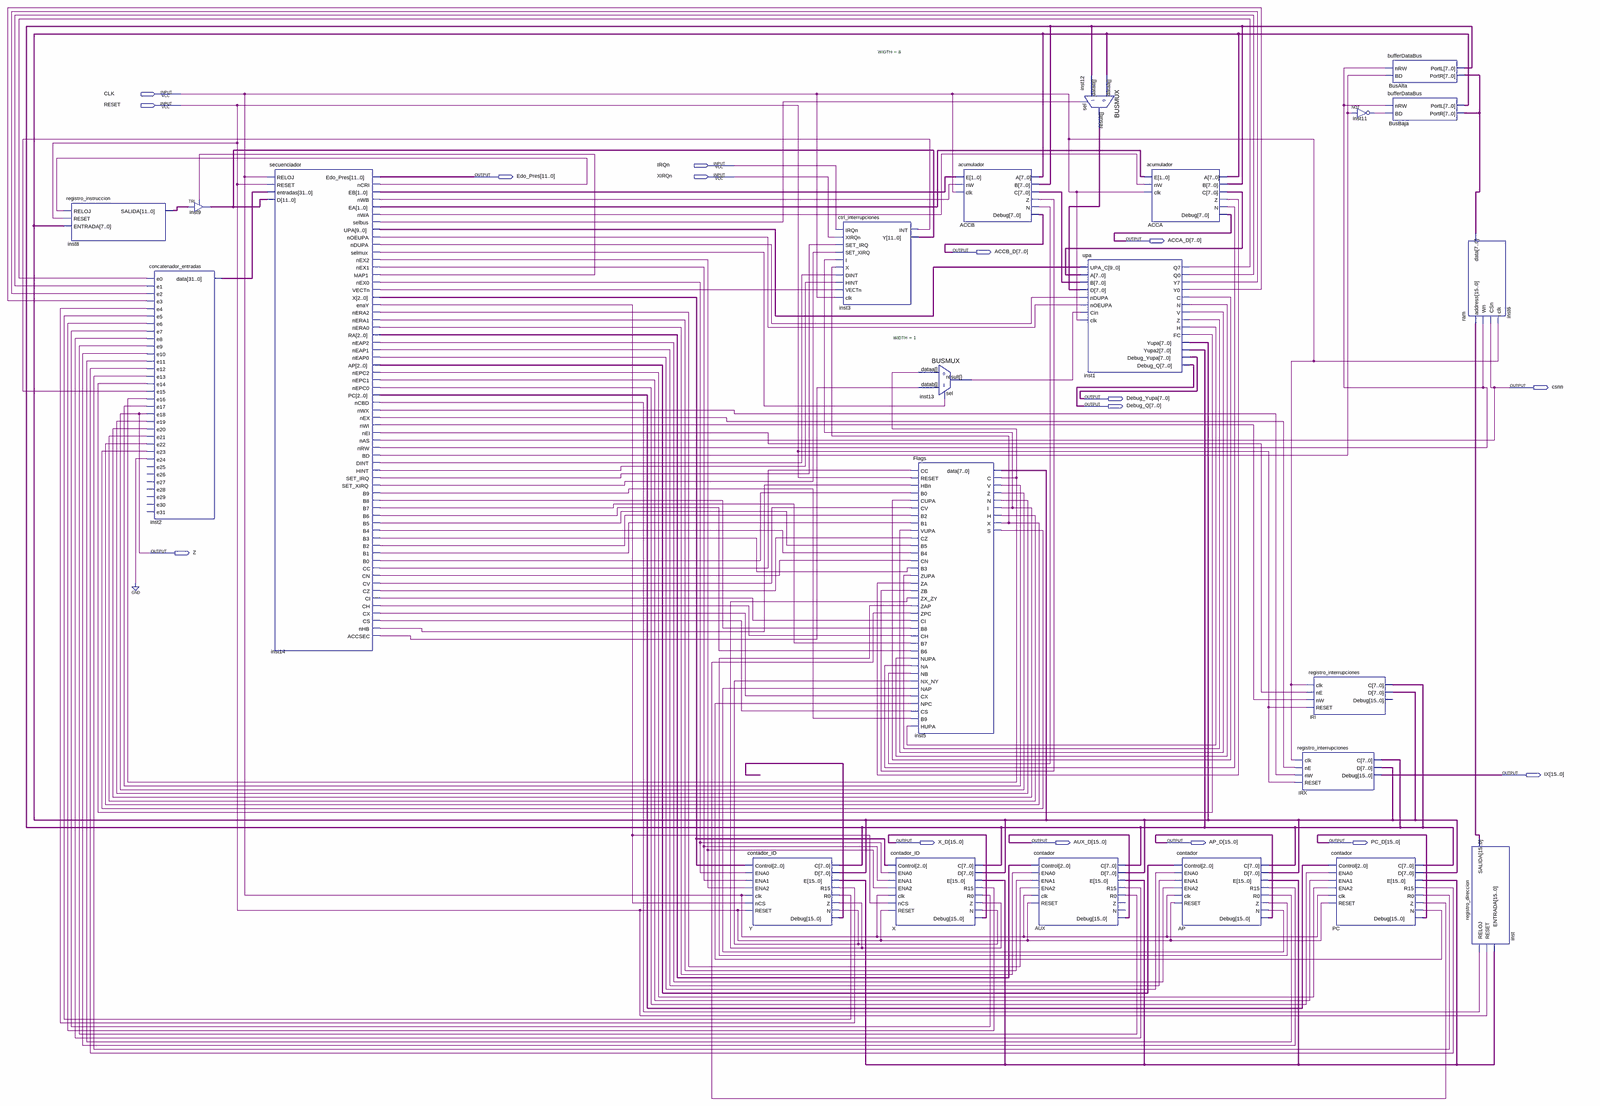
[diagram p0: schematic sheet, whole]
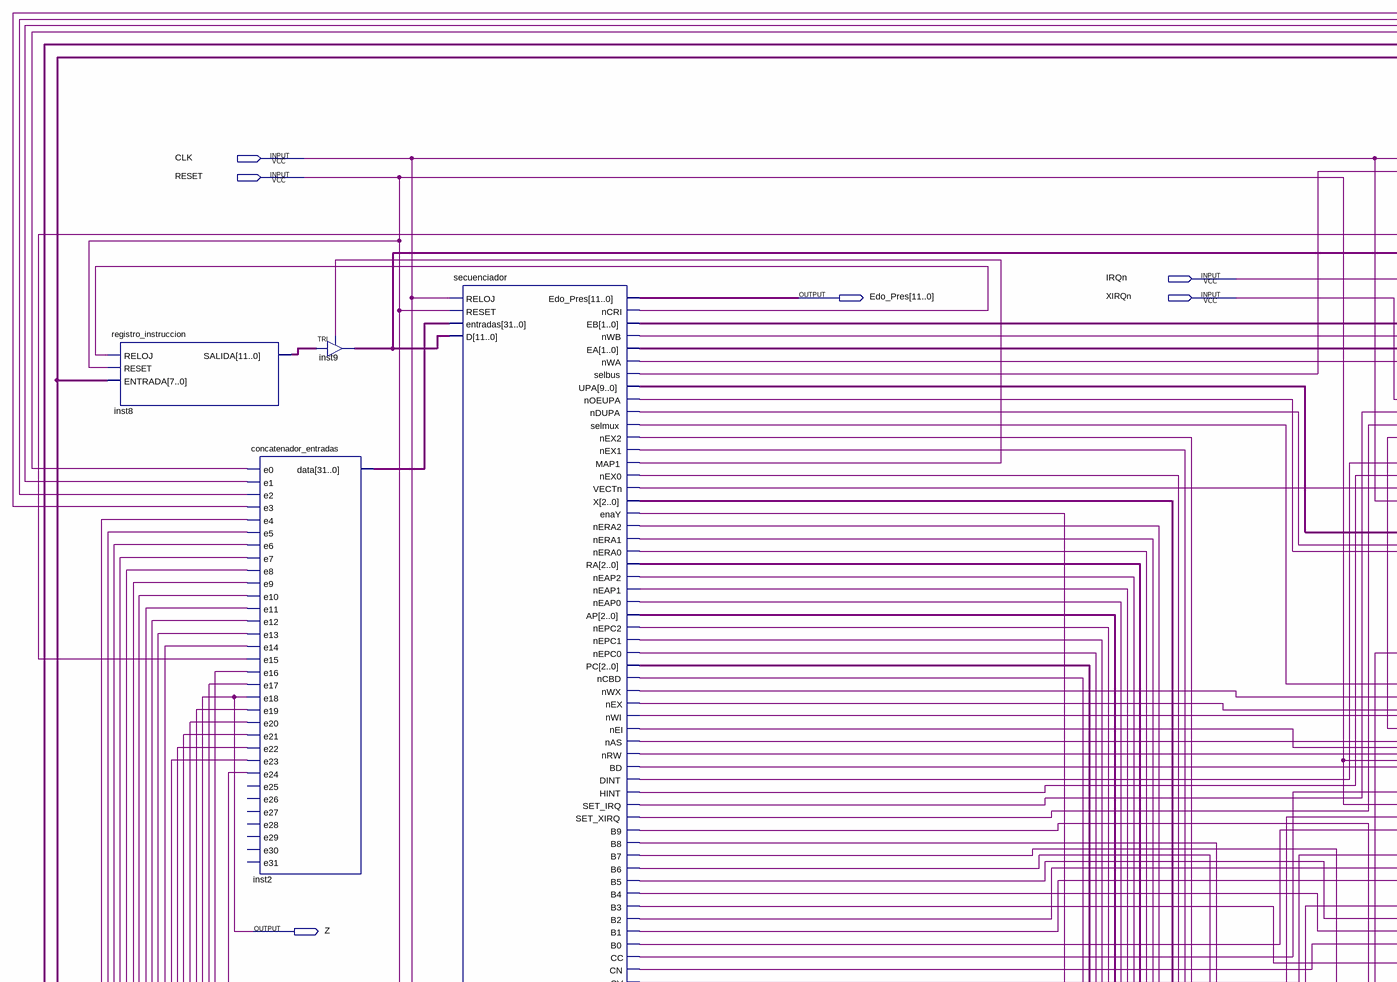
[diagram p1: schematic sheet, upper left part]
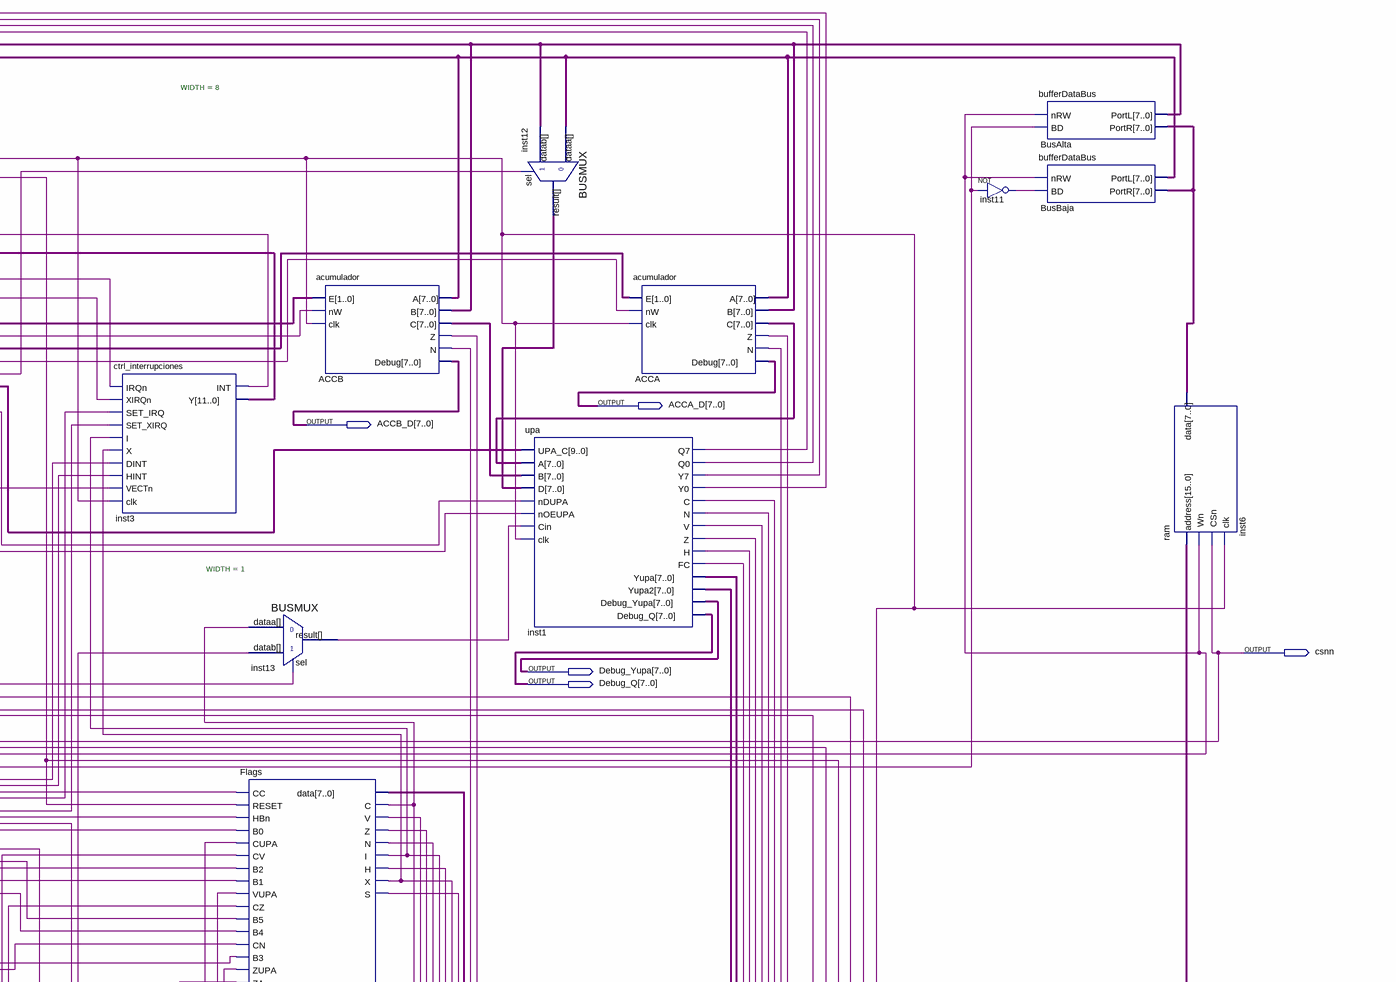
[diagram p2: schematic sheet, upper right part]
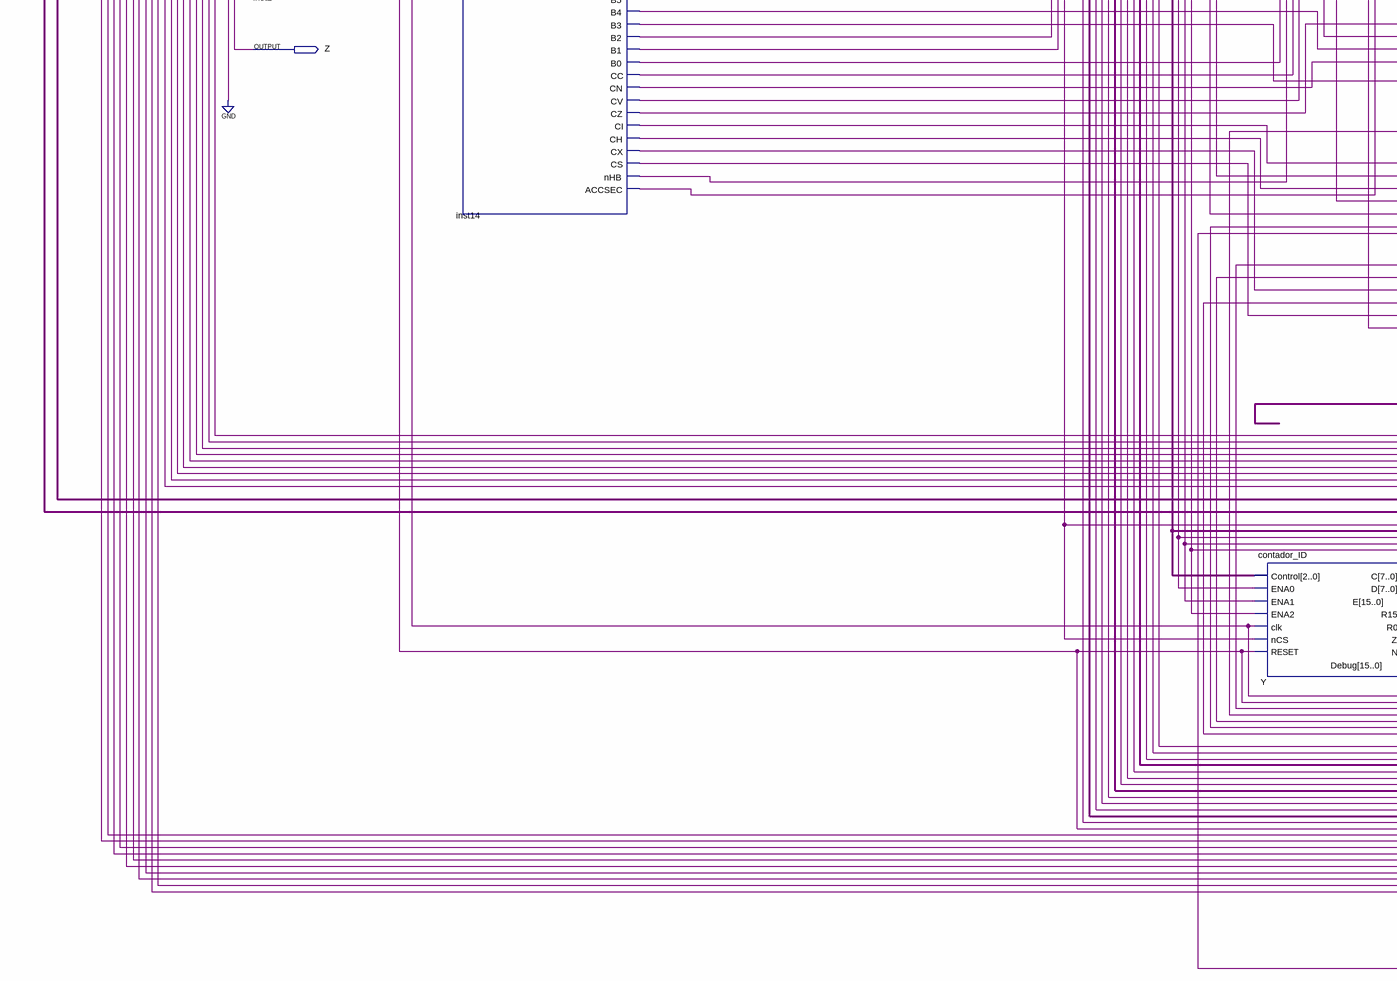
[diagram p3: schematic sheet, lower left part]
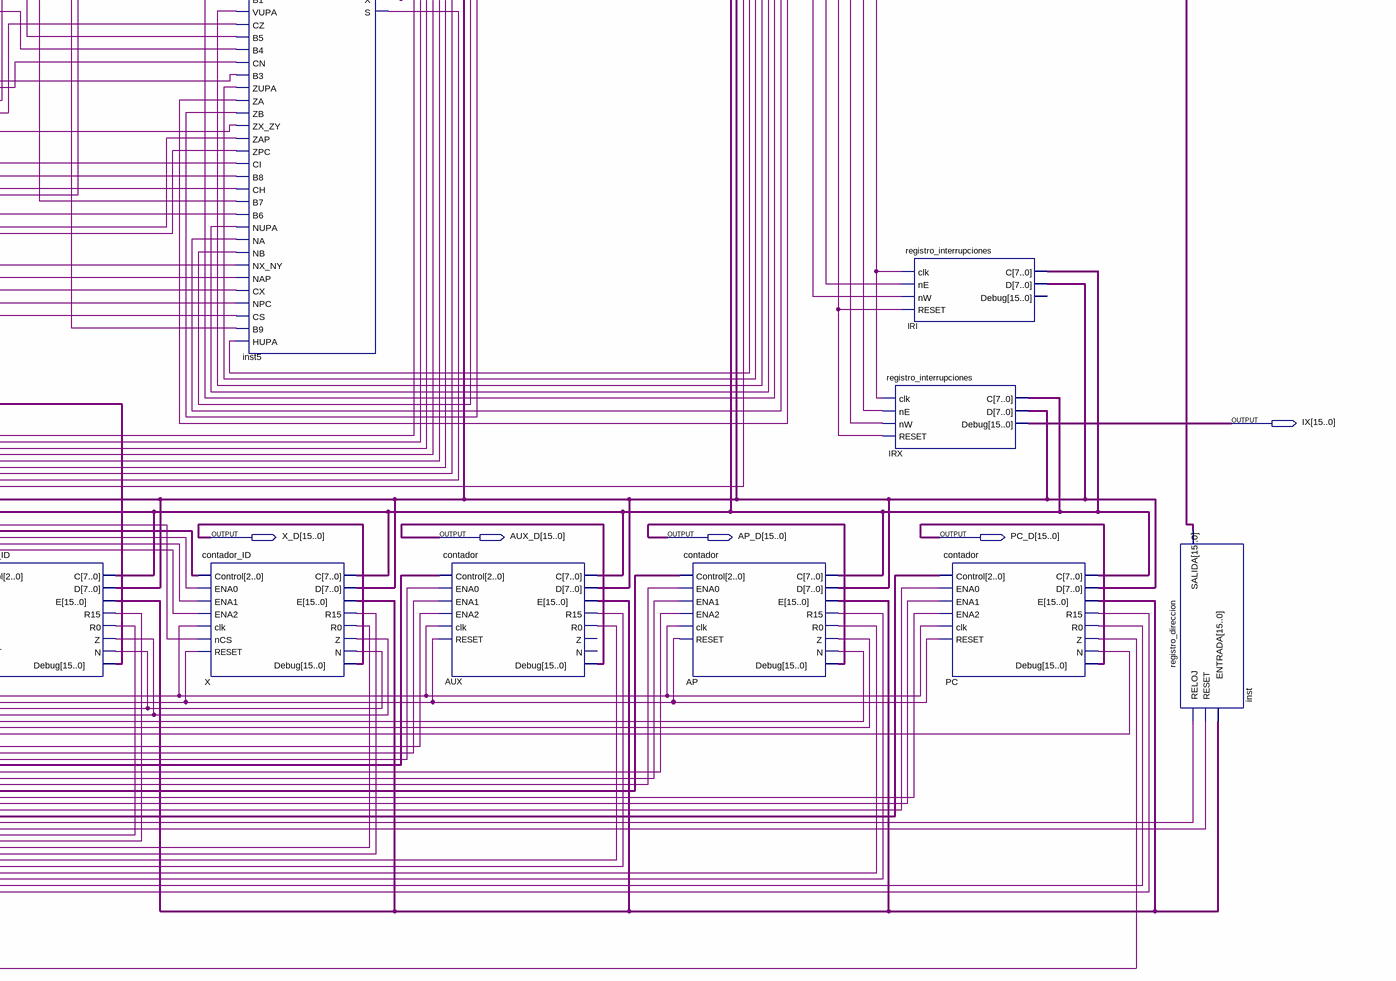
[diagram p4: schematic sheet, lower right part]
// Quartus schematic m68hc11.bdf as structural Verilog: 23 symbols, 16 pins
module m68hc11 (
  input  CLK,
  input  RESET,
  input  IRQn,
  input  XIRQn,
  output [11:0] Edo_Pres,
  output [7:0] ACCA_D,
  output [7:0] ACCB_D,
  output csnn,
  output [7:0] Debug_Yupa,
  output [7:0] Debug_Q,
  output Z,
  output [15:0] IX,
  output [15:0] X_D,
  output [15:0] AUX_D,
  output [15:0] AP_D,
  output [15:0] PC_D
);

  wire ACCA_n, ACCA_z, ACCB_n, ACCB_z, AP_n, AP_r0, AP_r15, AP_z, AUX_r0, AUX_r15, inst1_c, inst1_fc,
       inst1_h, inst1_n, inst1_q0, inst1_q7, inst1_v, inst1_y0, inst1_y7, inst1_z, inst3_int, inst5_c,
       inst5_h, inst5_i, inst5_n, inst5_s, inst5_v, inst5_x, inst11_out, inst13_result, inst14_accsec,
       inst14_b0, inst14_b1, inst14_b2, inst14_b3, inst14_b4, inst14_b5, inst14_b6, inst14_b7, inst14_b8,
       inst14_b9, inst14_bd, inst14_cc, inst14_ch, inst14_ci, inst14_cn, inst14_cs, inst14_cv, inst14_cx,
       inst14_cz, inst14_dint, inst14_enay, inst14_hint, inst14_map1, inst14_ncbd, inst14_ncri, inst14_ndupa,
       inst14_neap0, inst14_neap1, inst14_neap2, inst14_nei, inst14_nepc0, inst14_nepc1, inst14_nepc2,
       inst14_nera0, inst14_nera1, inst14_nera2, inst14_nex, inst14_nex0, inst14_nex1, inst14_nex2,
       inst14_nhb, inst14_noeupa, inst14_nrw, inst14_nwa, inst14_nwb, inst14_nwi, inst14_nwx, inst14_selbus,
       inst14_selmux, inst14_set_irq, inst14_set_xirq, inst14_vectn, PC_n, PC_r0, PC_r15, PC_z, X_r0, X_r15,
       Y_n, Y_r0, Y_r15, Y_z;
  wire [1:0] inst14_ea, inst14_eb;
  wire [2:0] inst14_ap, inst14_pc, inst14_ra, inst14_x;
  wire [7:0] ACCA_c, ACCB_c, BusAlta_portr, inst12_result, Y_c, Y_d;
  wire [9:0] inst14_upa;
  wire [11:0] inst8_salida, inst9_out;
  wire [15:0] inst_salida, Y_debug, Y_e;
  wire [31:0] inst2_data;

  registro_instruccion inst8 (.RELOJ(inst14_ncri), .RESET(RESET), .ENTRADA(Y_d), .SALIDA(inst8_salida));
  concatenador_entradas inst2 (
    .e0(inst1_q7), .e1(inst1_q0), .e2(inst1_y7), .e3(inst1_y0), .e4(Y_r15), .e5(Y_r0), .e6(X_r15), .e7(X_r0),
    .e8(AUX_r15), .e9(AUX_r0), .e10(AP_r15), .e11(AP_r0), .e12(PC_r15), .e13(PC_r0), .e14(inst1_fc),
    .e15(inst3_int), .e16(inst5_c), .e17(inst5_v), .e18(Z), .e19(inst5_n), .e20(inst5_i), .e21(inst5_h),
    .e22(inst5_x), .e23(inst5_s), .e24(1'b0), .data(inst2_data));  // open: e25, e26, e27, e28, e29, e30, e31
  TRI inst9[11:0] (.IN(inst8_salida), .OE(inst14_map1), .OUT(inst9_out));
  secuenciador inst14 (
    .RELOJ(CLK), .RESET(RESET), .entradas(inst2_data), .D(inst9_out), .Edo_Pres(Edo_Pres),
    .nCRI(inst14_ncri), .EB(inst14_eb), .nWB(inst14_nwb), .EA(inst14_ea), .nWA(inst14_nwa),
    .selbus(inst14_selbus), .UPA(inst14_upa), .nOEUPA(inst14_noeupa), .nDUPA(inst14_ndupa),
    .selmux(inst14_selmux), .nEX2(inst14_nex2), .nEX1(inst14_nex1), .MAP1(inst14_map1), .nEX0(inst14_nex0),
    .VECTn(inst14_vectn), .X(inst14_x), .enaY(inst14_enay), .nERA2(inst14_nera2), .nERA1(inst14_nera1),
    .nERA0(inst14_nera0), .RA(inst14_ra), .nEAP2(inst14_neap2), .nEAP1(inst14_neap1), .nEAP0(inst14_neap0),
    .AP(inst14_ap), .nEPC2(inst14_nepc2), .nEPC1(inst14_nepc1), .nEPC0(inst14_nepc0), .PC(inst14_pc),
    .nCBD(inst14_ncbd), .nWX(inst14_nwx), .nEX(inst14_nex), .nWI(inst14_nwi), .nEI(inst14_nei), .nAS(csnn),
    .nRW(inst14_nrw), .BD(inst14_bd), .DINT(inst14_dint), .HINT(inst14_hint), .SET_IRQ(inst14_set_irq),
    .SET_XIRQ(inst14_set_xirq), .B9(inst14_b9), .B8(inst14_b8), .B7(inst14_b7), .B6(inst14_b6),
    .B5(inst14_b5), .B4(inst14_b4), .B3(inst14_b3), .B2(inst14_b2), .B1(inst14_b1), .B0(inst14_b0),
    .CC(inst14_cc), .CN(inst14_cn), .CV(inst14_cv), .CZ(inst14_cz), .CI(inst14_ci), .CH(inst14_ch),
    .CX(inst14_cx), .CS(inst14_cs), .nHB(inst14_nhb), .ACCSEC(inst14_accsec));
  contador_ID Y (
    .Control(inst14_x), .ENA0(inst14_nex0), .ENA1(inst14_nex1), .ENA2(inst14_nex2), .clk(CLK),
    .nCS(inst14_enay), .RESET(RESET), .E(Y_e), .Z(Y_z), .N(Y_n), .Debug(Y_debug), .C(Y_c), .D(Y_d),
    .R15(Y_r15), .R0(Y_r0));
  ctrl_interrupciones inst3 (
    .IRQn(IRQn), .XIRQn(XIRQn), .SET_IRQ(inst14_set_irq), .SET_XIRQ(inst14_set_xirq), .I(inst5_i),
    .X(inst5_x), .DINT(inst14_dint), .HINT(inst14_hint), .VECTn(inst14_vectn), .clk(CLK), .INT(inst3_int),
    .Y(inst9_out));
  contador_ID X (
    .Control(inst14_x), .ENA0(inst14_nex0), .ENA1(inst14_nex1), .ENA2(inst14_nex2), .clk(CLK),
    .nCS(inst14_enay), .RESET(RESET), .E(Y_e), .Z(Y_z), .N(Y_n), .Debug(X_D), .C(Y_c), .D(Y_d), .R15(X_r15),
    .R0(X_r0));
  BUSMUX #(.WIDTH(1)) inst13 (.datab(inst14_accsec), .sel(inst14_selmux), .dataa(inst5_c), .result(inst13_result));
  Flags inst5 (
    .CC(inst14_cc), .RESET(RESET), .HBn(inst14_nhb), .B0(inst14_b0), .CUPA(inst1_c), .CV(inst14_cv),
    .B2(inst14_b2), .B1(inst14_b1), .VUPA(inst1_v), .CZ(inst14_cz), .B5(inst14_b5), .B4(inst14_b4),
    .CN(inst14_cn), .B3(inst14_b3), .ZUPA(inst1_z), .ZA(ACCA_z), .ZB(ACCB_z), .ZX_ZY(Y_z), .ZAP(AP_z),
    .ZPC(PC_z), .CI(inst14_ci), .B8(inst14_b8), .CH(inst14_ch), .B7(inst14_b7), .B6(inst14_b6),
    .NUPA(inst1_n), .NA(ACCA_n), .NB(ACCB_n), .NX_NY(Y_n), .NAP(AP_n), .CX(inst14_cx), .NPC(PC_n),
    .CS(inst14_cs), .B9(inst14_b9), .HUPA(inst1_h), .C(inst5_c), .V(inst5_v), .Z(Z), .N(inst5_n),
    .I(inst5_i), .H(inst5_h), .X(inst5_x), .S(inst5_s), .data(Y_d));
  acumulador ACCB (
    .E(inst14_eb), .nW(inst14_nwb), .clk(CLK), .Z(ACCB_z), .N(ACCB_n), .Debug(ACCB_D), .A(Y_d), .B(Y_c),
    .C(ACCB_c));
  contador AUX (
    .Control(inst14_ra), .ENA0(inst14_nera0), .ENA1(inst14_nera1), .ENA2(inst14_nera2), .clk(CLK),
    .RESET(RESET), .E(Y_e), .Debug(AUX_D), .C(Y_c), .D(Y_d), .R15(AUX_r15), .R0(AUX_r0));  // open: Z, N
  BUSMUX #(.WIDTH(8)) inst12 (.datab(Y_c), .sel(inst14_selbus), .dataa(Y_d), .result(inst12_result));
  upa inst1 (
    .UPA_C(inst14_upa), .A(ACCA_c), .B(ACCB_c), .D(inst12_result), .nDUPA(inst14_ndupa),
    .nOEUPA(inst14_noeupa), .Cin(inst13_result), .clk(CLK), .Q7(inst1_q7), .Q0(inst1_q0), .Y7(inst1_y7),
    .Y0(inst1_y0), .C(inst1_c), .N(inst1_n), .V(inst1_v), .Z(inst1_z), .H(inst1_h), .FC(inst1_fc),
    .Yupa(Y_d), .Yupa2(Y_c), .Debug_Yupa(Debug_Yupa), .Debug_Q(Debug_Q));
  acumulador ACCA (
    .E(inst14_ea), .nW(inst14_nwa), .clk(CLK), .Z(ACCA_z), .N(ACCA_n), .Debug(ACCA_D), .A(Y_d), .B(Y_c),
    .C(ACCA_c));
  contador AP (
    .Control(inst14_ap), .ENA0(inst14_neap0), .ENA1(inst14_neap1), .ENA2(inst14_neap2), .clk(CLK),
    .RESET(RESET), .E(Y_e), .Z(AP_z), .N(AP_n), .Debug(AP_D), .C(Y_c), .D(Y_d), .R15(AP_r15), .R0(AP_r0));
  registro_interrupciones IRX (
    .clk(CLK), .nE(inst14_nex), .nW(inst14_nwx), .RESET(RESET), .Debug(IX), .C(Y_c), .D(Y_d));
  registro_interrupciones IRI (
    .clk(CLK), .nE(inst14_nei), .nW(inst14_nwi), .RESET(RESET), .C(Y_c), .D(Y_d));  // open: Debug
  not inst11 (inst11_out, inst14_bd);
  contador PC (
    .Control(inst14_pc), .ENA0(inst14_nepc0), .ENA1(inst14_nepc1), .ENA2(inst14_nepc2), .clk(CLK),
    .RESET(RESET), .E(Y_e), .Z(PC_z), .N(PC_n), .Debug(PC_D), .C(Y_c), .D(Y_d), .R15(PC_r15), .R0(PC_r0));
  bufferDataBus BusAlta (.nRW(inst14_nrw), .BD(inst14_bd), .PortL(Y_c), .PortR(BusAlta_portr));
  bufferDataBus BusBaja (.nRW(inst14_nrw), .BD(inst11_out), .PortL(Y_d), .PortR(BusAlta_portr));
  ram inst6 (.address(inst_salida), .Wn(inst14_nrw), .CSn(csnn), .clk(CLK), .data(BusAlta_portr));
  registro_direccion inst (.RELOJ(inst14_ncbd), .RESET(RESET), .ENTRADA(Y_e), .SALIDA(inst_salida));
endmodule
